# Altium schematic sheet BEAMFORMER.SchDoc (part 1 of 3)
size Letter; DrawnBy: Titan Yuan; SheetNumber: 1; SheetTotal: 9
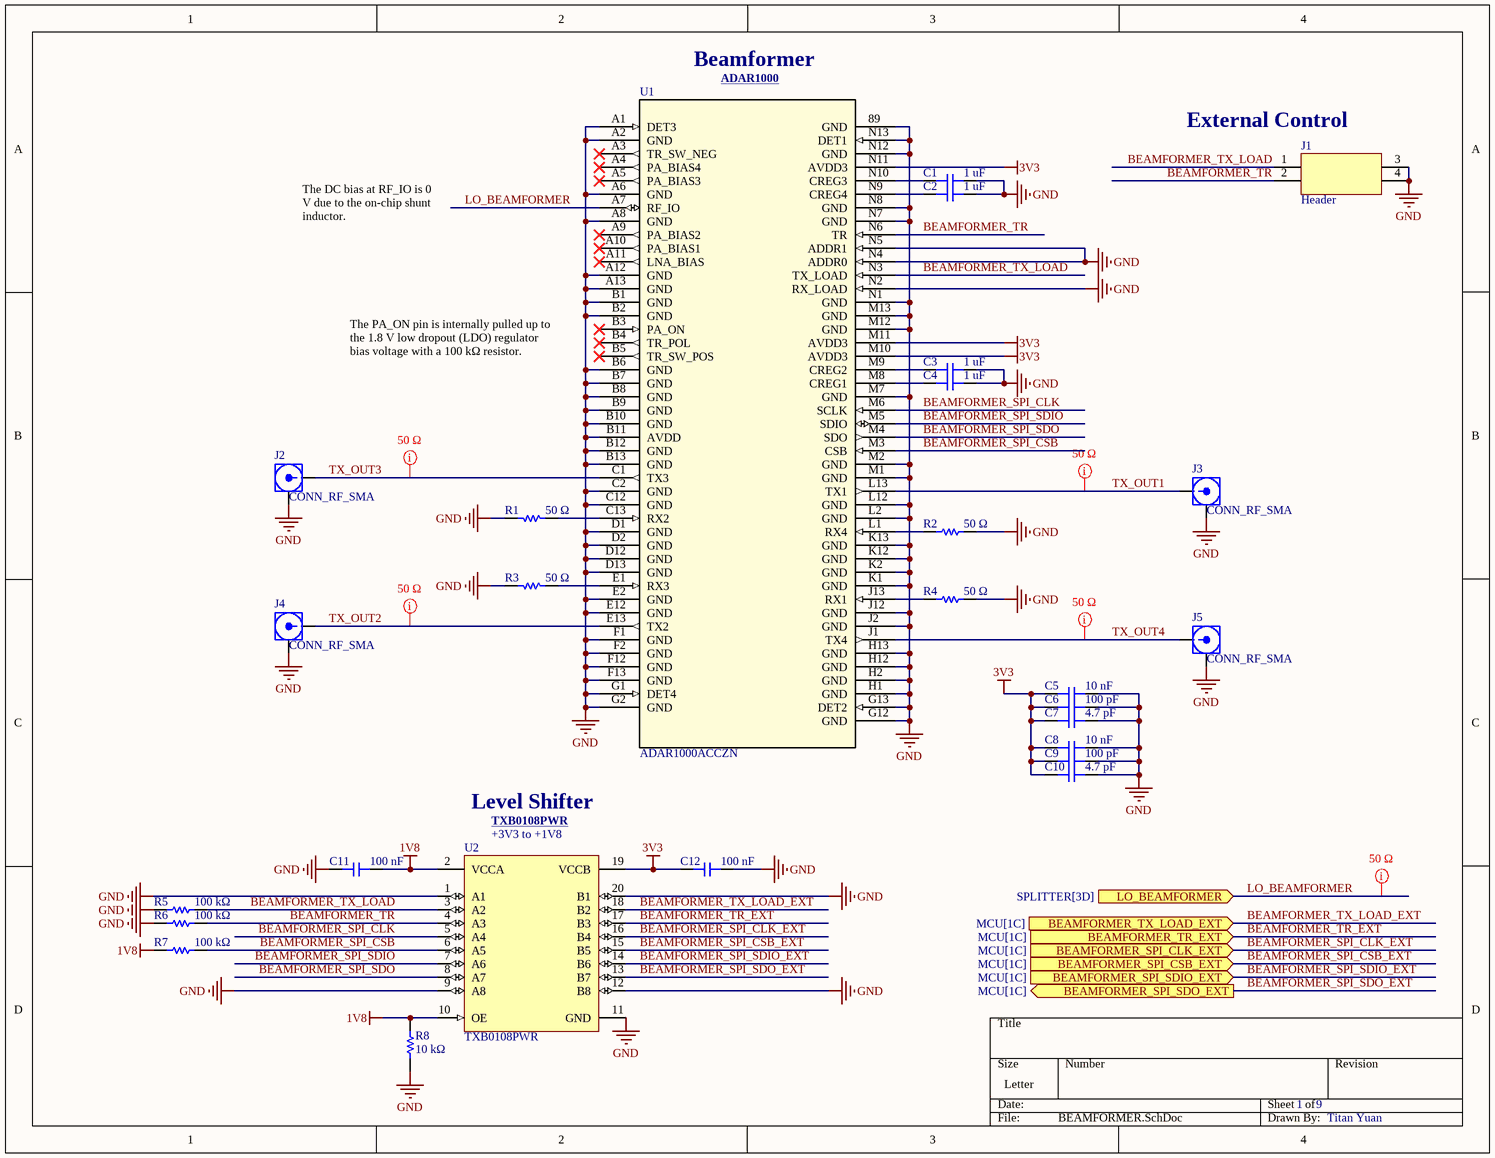
[diagram p0: BEAMFORMER.SchDoc]

## Parts
C1  1 uF  [CAP_0603]
C2  1 uF  [CAP_0603]
C3  1 uF  [CAP_0603]
C4  1 uF  [CAP_0603]
C5  10 nF  [CAP_0402]
C6  100 pF  [CAP_0402]
C7  4.7 pF  [CAP_0402]
C8  10 nF  [CAP_0402]
C9  100 pF  [CAP_0402]
C10  4.7 pF  [CAP_0402]
C11  100 nF  [CAP_0402]
C12  100 nF  [CAP_0402]
J1  Header  [CONN_2x2_2.54mm_PinHeader_Vertical]
J2  CONN_RF_SMA  [142-0701-801]
J3  CONN_RF_SMA  [142-0701-801]
J4  CONN_RF_SMA  [142-0701-801]
J5  CONN_RF_SMA  [142-0701-801]
R1  50 Ω  [RES_0402]
R2  50 Ω  [RES_0402]
R3  50 Ω  [RES_0402]
R4  50 Ω  [RES_0402]
R5  100 kΩ  [RES_0402]
R6  100 kΩ  [RES_0402]
R7  100 kΩ  [RES_0402]
R8  10 kΩ  [RES_0402]
U1  ADAR1000ACCZN  [CC-88-1_ADI]
U2  TXB0108PWR  [TXB0108PWR]

## Ports
BEAMFORMER_SPI_CLK_EXT (in, see MCU[1C]), BEAMFORMER_SPI_CSB_EXT (in, see MCU[1C]), BEAMFORMER_SPI_SDIO_EXT (in, see MCU[1C]), BEAMFORMER_SPI_SDO_EXT (out, see MCU[1C]), BEAMFORMER_TR_EXT (in, see MCU[1C]), BEAMFORMER_TX_LOAD_EXT (in, see MCU[1C]), LO_BEAMFORMER (in, see SPLITTER[3D])

## Nets
1V8: C11.2 R7.1 R8.1 U2.2(VCCA) U2.10(OE)
3V3: C5.1 C6.2 C7.1 C8.1 C9.2 C10.1 C12.1 U1.M10(AVDD3) U1.M11(AVDD3) U1.N11(AVDD3) U2.19(VCCB)
GND: C1.1 C2.1 C3.1 C4.1 C5.2 C6.1 C7.2 C8.2 C9.1 C10.2 C11.1 C12.2 J1.3 J1.4 J2.2 J3.2 J4.2 J5.2 R1.1 R2.1 R3.1 R4.1 R5.1 R6.1 R8.2 U1.89(GND) U1.A1(DET3) U1.A2(GND) U1.A6(GND) U1.A8(GND) U1.A12(GND) U1.A13(GND) U1.B1(GND) U1.B2(GND) U1.B6(GND) U1.B7(GND) U1.B8(GND) U1.B9(GND) U1.B10(GND) U1.B11(AVDD) U1.B12(GND) U1.B13(GND) U1.C2(GND) U1.C12(GND) U1.D1(GND) U1.D2(GND) U1.D12(GND) U1.D13(GND) U1.E2(GND) U1.E12(GND) U1.F1(GND) U1.F2(GND) U1.F12(GND) U1.F13(GND) U1.G1(DET4) U1.G2(GND) U1.G12(GND) U1.G13(DET2) U1.H1(GND) U1.H2(GND) U1.H12(GND) U1.H13(GND) U1.J2(GND) U1.J12(GND) U1.K1(GND) U1.K2(GND) U1.K12(GND) U1.K13(GND) U1.L2(GND) U1.L12(GND) U1.M1(GND) U1.M2(GND) U1.M7(GND) U1.M12(GND) U1.M13(GND) U1.N1(GND) U1.N2(RX_LOAD) U1.N4(ADDR0) U1.N5(ADDR1) U1.N7(GND) U1.N8(GND) U1.N12(GND) U1.N13(DET1) U2.1(A1) U2.9(A8) U2.11(GND) U2.12(B8) U2.20(B1)
BEAMFORMER_SPI_CLK: U1.M6(SCLK) U2.5(A4)
BEAMFORMER_SPI_CLK_EXT: U2.16(B4) ; port BEAMFORMER_SPI_CLK_EXT
BEAMFORMER_SPI_CSB: R7.2 U1.M3(CSB) U2.6(A5)
BEAMFORMER_SPI_CSB_EXT: U2.15(B5) ; port BEAMFORMER_SPI_CSB_EXT
BEAMFORMER_SPI_SDIO: U1.M5(SDIO) U2.7(A6)
BEAMFORMER_SPI_SDIO_EXT: U2.14(B6) ; port BEAMFORMER_SPI_SDIO_EXT
BEAMFORMER_SPI_SDO: U1.M4(SDO) U2.8(A7)
BEAMFORMER_SPI_SDO_EXT: U2.13(B7) ; port BEAMFORMER_SPI_SDO_EXT
BEAMFORMER_TR: J1.2 R6.2 U1.N6(TR) U2.4(A3)
BEAMFORMER_TR_EXT: U2.17(B3) ; port BEAMFORMER_TR_EXT
BEAMFORMER_TX_LOAD: J1.1 R5.2 U1.N3(TX_LOAD) U2.3(A2)
BEAMFORMER_TX_LOAD_EXT: U2.18(B2) ; port BEAMFORMER_TX_LOAD_EXT
LO_BEAMFORMER: U1.A7(RF_IO) ; port LO_BEAMFORMER
TX_OUT1: J3.1 U1.L13(TX1)
TX_OUT2: J4.1 U1.E13(TX2)
TX_OUT3: J2.1 U1.C1(TX3)
TX_OUT4: J5.1 U1.J1(TX4)
NetC1_2: C1.2 U1.N10(CREG3)
NetC2_2: C2.2 U1.N9(CREG4)
NetC3_2: C3.2 U1.M9(CREG2)
NetC4_2: C4.2 U1.M8(CREG1)
NetR1_2: R1.2 U1.C13(RX2)
NetR2_2: R2.2 U1.L1(RX4)
NetR3_2: R3.2 U1.E1(RX3)
NetR4_2: R4.2 U1.J13(RX1)

Not connected (* = marked no-connect by the designer): U1 A3(TR_SW_NEG)* A4(PA_BIAS4)* A5(PA_BIAS3)* A9(PA_BIAS2)* A10(PA_BIAS1)* A11(LNA_BIAS)* B3(PA_ON)* B4(TR_POL)* B5(TR_SW_POS)*

## Layout directives
net class 50 Ω: LO_BEAMFORMER, TX_OUT1, TX_OUT2, TX_OUT3, TX_OUT4

## Notes on the sheet
- Beamformer
- (near U1) ADAR1000 <https://www.analog.com/en/products/adar1000.html>
- (near J1) External Control
- The DC bias at RF_IO is 0 V due to the on-chip shunt inductor.
- The PA_ON pin is internally pulled up to the 1.8 V low dropout (LDO) regulator bias voltage with a 100 kΩ resistor.
- Level Shifter
- (near U2) +3V3 to +1V8
- (near U2) TXB0108PWR <https://www.ti.com/product/TXB0108>